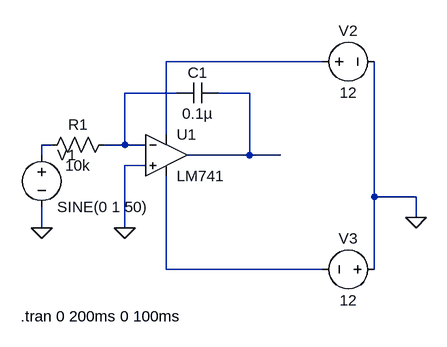
[diagram p0: schematic Integrator.asc]
Integrator.asc, the LTspice schematic file:
Version 4.1
SHEET 1 880 680
WIRE 368 -48 128 -48
WIRE 144 0 64 0
WIRE 256 0 208 0
WIRE 128 64 128 -48
WIRE -48 80 -64 80
WIRE 64 80 64 0
WIRE 64 80 32 80
WIRE 96 80 64 80
WIRE -64 96 -64 80
WIRE 256 96 256 0
WIRE 256 96 160 96
WIRE 304 96 256 96
WIRE 96 112 64 112
WIRE 448 160 448 -48
WIRE 512 160 448 160
WIRE 512 192 512 160
WIRE -64 208 -64 176
WIRE 64 208 64 112
WIRE 128 272 128 128
WIRE 368 272 128 272
WIRE 448 272 448 160
FLAG -64 208 0
FLAG 64 208 0
FLAG 512 192 0
SYMBOL voltage -64 80 R0
WINDOW 123 0 0 Left 0
WINDOW 39 0 0 Left 0
SYMATTR InstName V1
SYMATTR Value SINE(0 1 50)
SYMBOL res 48 64 R90
WINDOW 0 0 56 VBottom 2
WINDOW 3 32 56 VTop 2
SYMATTR InstName R1
SYMATTR Value 10k
SYMBOL voltage 352 -48 R270
WINDOW 0 32 56 VTop 2
WINDOW 3 -32 56 VBottom 2
WINDOW 123 0 0 Left 0
WINDOW 39 0 0 Left 0
SYMATTR InstName V2
SYMATTR Value 12
SYMBOL voltage 464 272 R90
WINDOW 0 -32 56 VBottom 2
WINDOW 3 32 56 VTop 2
WINDOW 123 0 0 Left 0
WINDOW 39 0 0 Left 0
SYMATTR InstName V3
SYMATTR Value 12
SYMBOL OpAmps\\LM741 128 32 R0
SYMATTR InstName U1
SYMBOL cap 208 -16 R90
WINDOW 0 0 32 VBottom 2
WINDOW 3 32 32 VTop 2
SYMATTR InstName C1
SYMATTR Value 0.1µ
TEXT -96 344 Left 2 !.tran 0 200ms 0 100ms

The netlist it stands for:
* Integrator.asc
V1 N004 0 SINE(0 1 50)
R1 N002 N004 10k
V2 N001 0 12
V3 0 N005 12
X§U1 0 N002 N001 N005 N003 LM741  ; pins In+ In- V+ V- OUT
C1 N003 N002 0.1µ
.tran 0 200ms 0 100ms
.lib LM741.lib
.backanno
.end